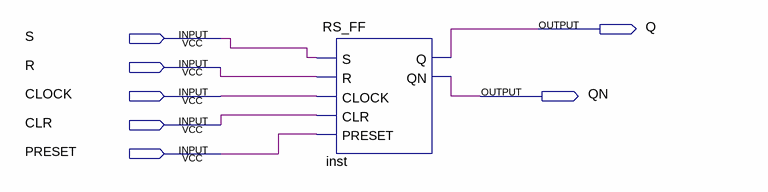
[diagram p0: schematic sheet]
// Quartus schematic lab13_1.bdf as structural Verilog: 1 symbols, 7 pins
module lab13_1 (
  input  S,
  input  R,
  input  CLOCK,
  input  CLR,
  input  PRESET,
  output Q,
  output QN
);

  RS_FF inst (.S(S), .R(R), .CLOCK(CLOCK), .CLR(CLR), .PRESET(PRESET), .Q(Q), .QN(QN));
endmodule
